# Altium schematic sheet DomOctopus.SchDoc
size A3
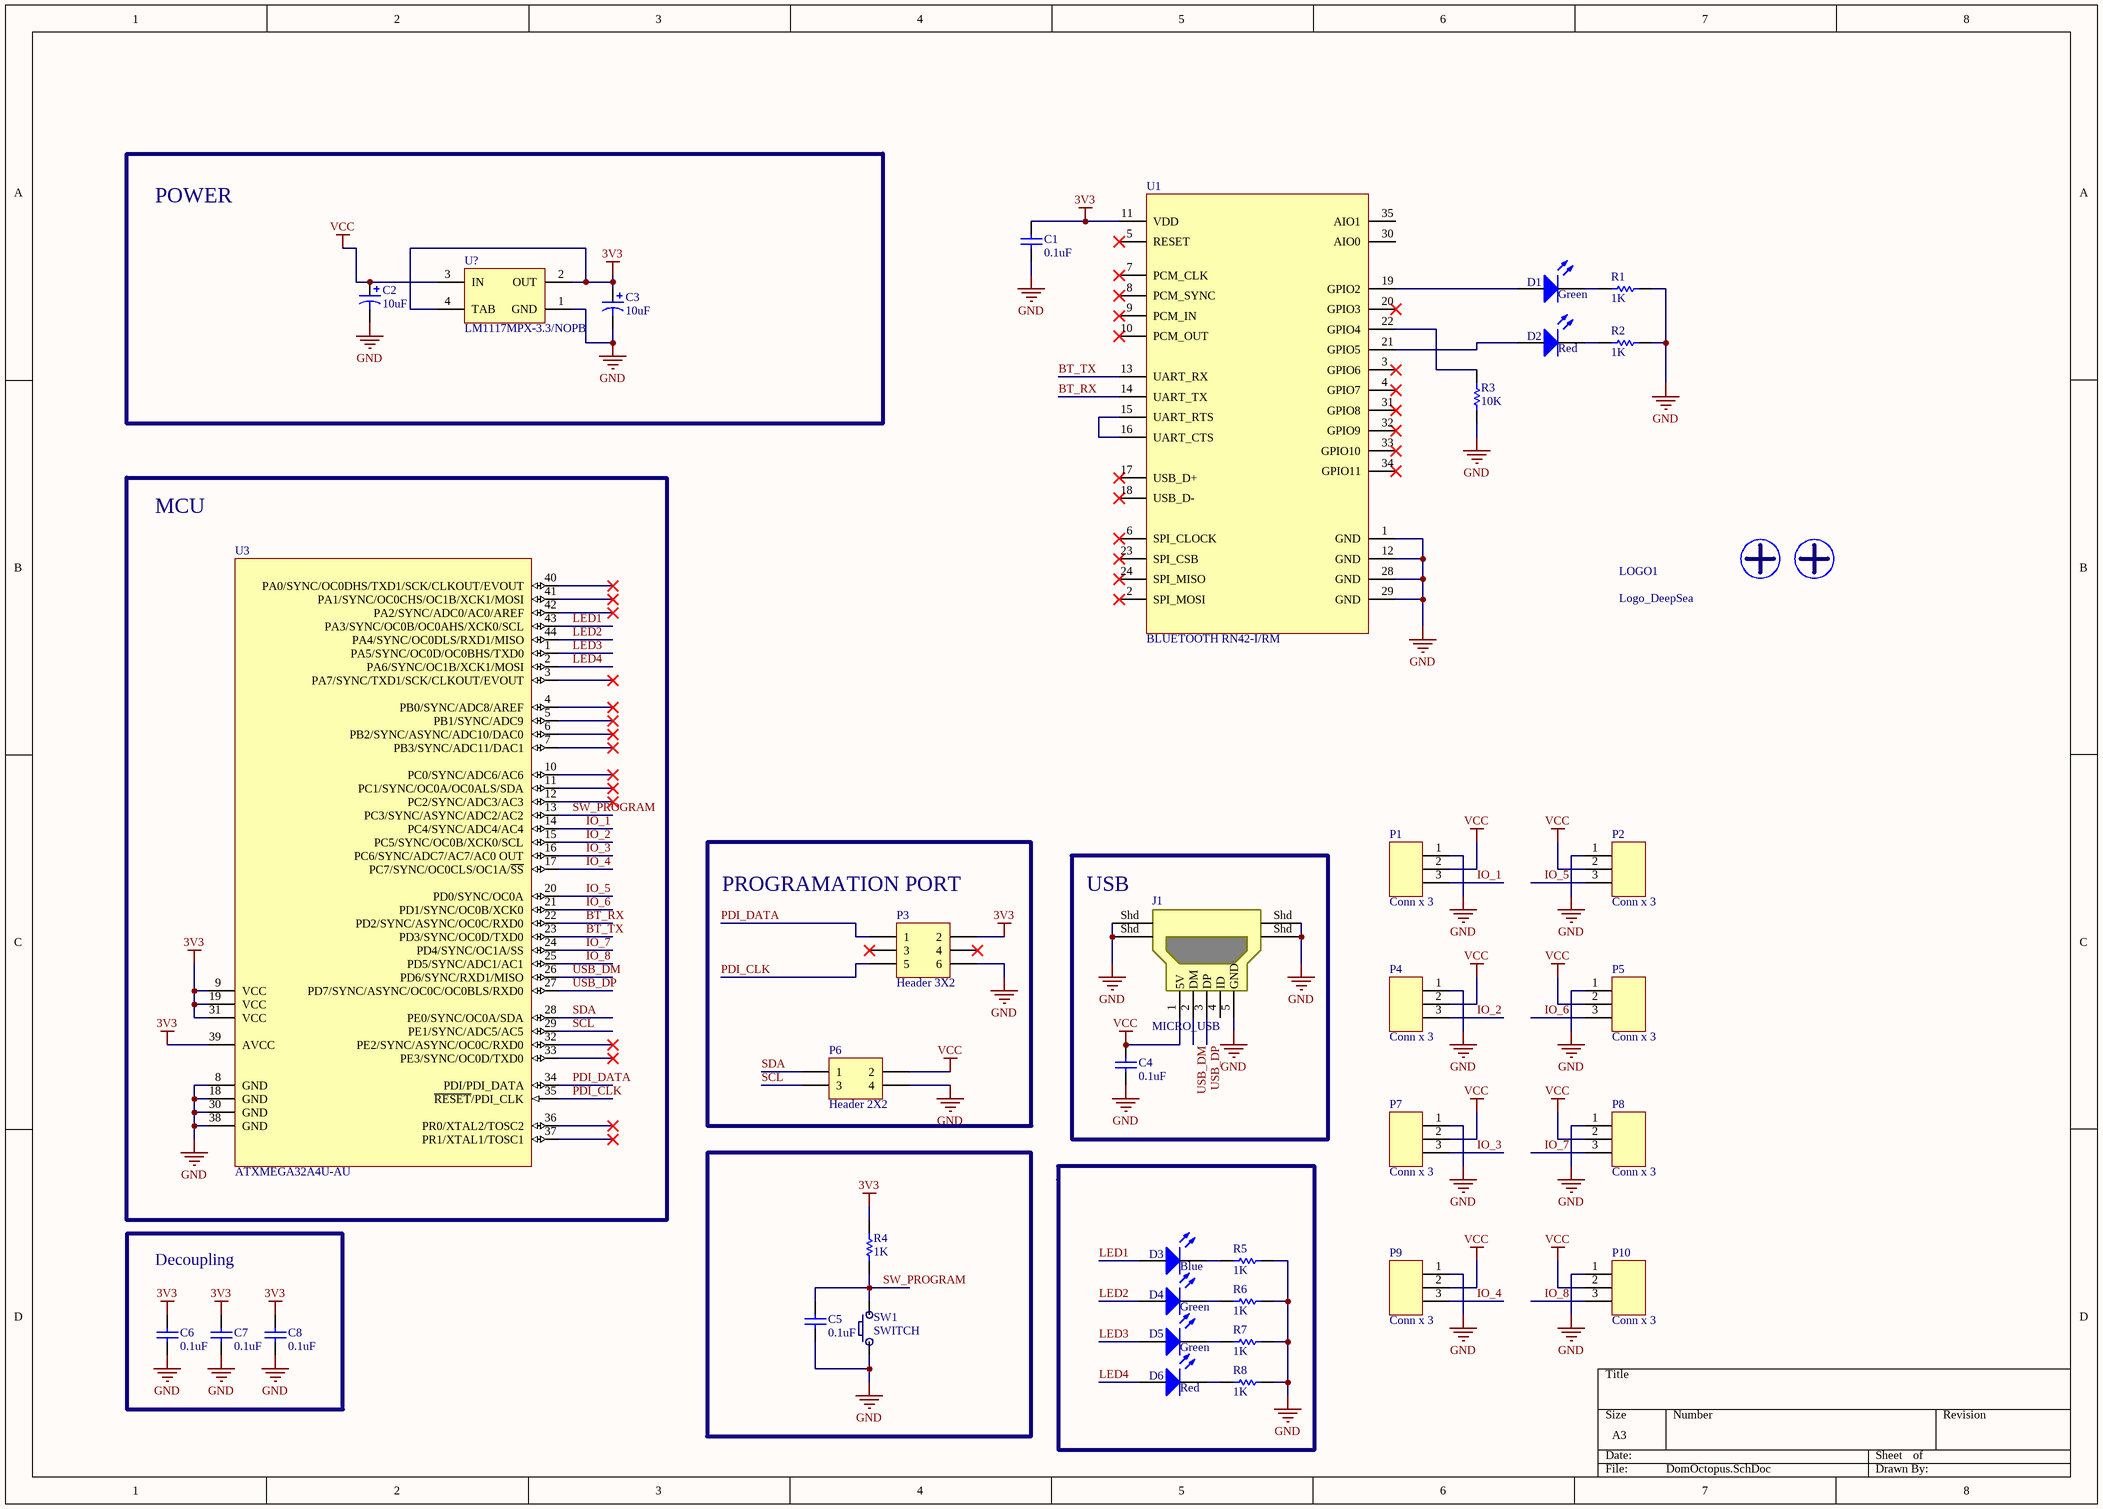
[diagram p0: DomOctopus.SchDoc]

## Parts
C1  0.1uF  [C0603_N]
C2  10uF  [C_TANT_A_3216_N]
C3  10uF  [C_TANT_A_3216_N]
C4  0.1uF  [C0603_N]
C5  0.1uF  [C0603_N]
C6  0.1uF  [C0603_N]
C7  0.1uF  [C0603_N]
C8  0.1uF  [C0603_N]
D1  Green  [R0603_N]
D2  Red  [R0603_N]
D3  Blue  [R0603_N]
D4  Green  [R0603_N]
D5  Green  [R0603_N]
D6  Red  [R0603_N]
J1  MICRO_USB  [USB_MICRO_SMD]
LOGO1  Logo_DeepSea  [DeepSea_logo1]
M1  MountingHole-1/8in  [MoutingHole-1/8in]  (value not drawn)
M2  MountingHole-1/8in  [MoutingHole-1/8in]  (value not drawn)
P1  Conn x 3  [conn x 3]
P2  Conn x 3  [conn x 3]
P3  Header 3X2  [HDR2X3]
P4  Conn x 3  [conn x 3]
P5  Conn x 3  [conn x 3]
P6  Header 2X2  [HDR2X2]
P7  Conn x 3  [conn x 3]
P8  Conn x 3  [conn x 3]
P9  Conn x 3  [conn x 3]
P10  Conn x 3  [conn x 3]
R1  1K  [R0603_N]
R2  1K  [R0603_N]
R3  10K  [R0603_N]
R4  1K  [R0603_N]
R5  1K  [R0603_N]
R6  1K  [R0603_N]
R7  1K  [R0603_N]
R8  1K  [R0603_N]
SW1  SWITCH  [swich_foot]
U1  BLUETOOTH RN42-I/RM  [RN42]
U3  ATXMEGA32A4U-AU  [44A_M]
U?  LM1117MPX-3.3/NOPB  [MP04A_N]

## Nets
3V3: C1.2 C3.1 C6.2 C7.2 C8.2 P3.2 R4.2 U1.11(VDD) U3.9(VCC) U3.19(VCC) U3.31(VCC) U3.39(AVCC) U?.2(OUT) U?.4(TAB)
GND: C1.1 C2.2 C3.2 C4.1 C5.2 C6.1 C7.1 C8.1 J1.5(GND) J1.Shd P1.1 P2.1 P3.6 P4.1 P5.1 P6.4 P7.1 P8.1 P9.1 P10.1 R1.1 R2.1 R3.2 R5.1 R6.1 R7.1 R8.1 SW1.1 U1.1(GND) U1.12(GND) U1.28(GND) U1.29(GND) U3.8(GND) U3.18(GND) U3.30(GND) U3.38(GND) U?.1(GND)
VCC: C2.1 C4.2 J1.1(5V) P1.2 P2.2 P4.2 P5.2 P6.2 P7.2 P8.2 P9.2 P10.2 U?.3(IN)
BT_RX: U1.14(UART_TX) U3.22(PD2/SYNC/ASYNC/OC0C/RXD0)
BT_TX: U1.13(UART_RX) U3.23(PD3/SYNC/OC0D/TXD0)
IO_1: P1.3 U3.14(PC4/SYNC/ADC4/AC4)
IO_2: P4.3 U3.15(PC5/SYNC/OC0B/XCK0/SCL)
IO_3: P7.3 U3.16(PC6/SYNC/ADC7/AC7/AC0_OUT)
IO_4: P9.3 U3.17(PC7/SYNC/OC0CLS/OC1A/~{SS})
IO_5: P2.3 U3.20(PD0/SYNC/OC0A)
IO_6: P5.3 U3.21(PD1/SYNC/OC0B/XCK0)
IO_7: P8.3 U3.24(PD4/SYNC/OC1A/SS)
IO_8: P10.3 U3.25(PD5/SYNC/ADC1/AC1)
LED1: D3.1(A) U3.43(PA3/SYNC/OC0B/OC0AHS/XCK0/SCL)
LED2: D4.1(A) U3.44(PA4/SYNC/OC0DLS/RXD1/MISO)
LED3: D5.1(A) U3.1(PA5/SYNC/OC0D/OC0BHS/TXD0)
LED4: D6.1(A) U3.2(PA6/SYNC/OC1B/XCK1/MOSI)
PDI_CLK: P3.5 U3.35(~{RESET}/PDI_CLK)
PDI_DATA: P3.1 U3.34(PDI/PDI_DATA)
SCL: P6.3 U3.29(PE1/SYNC/ADC5/AC5)
SDA: P6.1 U3.28(PE0/SYNC/OC0A/SDA)
SW_PROGRAM: C5.1 R4.1 SW1.2 U3.13(PC3/SYNC/ASYNC/ADC2/AC2)
USB_DM: J1.2(DM) U3.26(PD6/SYNC/RXD1/MISO)
USB_DP: J1.3(DP) U3.27(PD7/SYNC/ASYNC/OC0C/OC0BLS/RXD0)
NetD1_1: D1.1(A) U1.19(GPIO2)
NetD1_2: D1.2(K) R1.2
NetD2_1: D2.1(A) U1.21(GPIO5)
NetD2_2: D2.2(K) R2.2
NetD3_2: D3.2(K) R5.2
NetD4_2: D4.2(K) R6.2
NetD5_2: D5.2(K) R7.2
NetD6_2: D6.2(K) R8.2
NetR3_1: R3.1 U1.22(GPIO4)
NetU1_15: U1.15(UART_RTS) U1.16(UART_CTS)

Not connected (* = marked no-connect by the designer): J1 4(ID); P3 3* 4*; U1 2(SPI_MOSI)* 3(GPIO6)* 4(GPIO7)* 5(RESET)* 6(SPI_CLOCK)* 7(PCM_CLK)* 8(PCM_SYNC)* 9(PCM_IN)* 10(PCM_OUT)* 17(USB_D+)* 18(USB_D-)* 20(GPIO3)* 23(SPI_CSB)* 24(SPI_MISO)* 30(AIO0) 31(GPIO8)* 32(GPIO9)* 33(GPIO10)* 34(GPIO11)* 35(AIO1); U3 3(PA7/SYNC/TXD1/SCK/CLKOUT/EVOUT)* 4(PB0/SYNC/ADC8/AREF)* 5(PB1/SYNC/ADC9)* 6(PB2/SYNC/ASYNC/ADC10/DAC0)* 7(PB3/SYNC/ADC11/DAC1)* 10(PC0/SYNC/ADC6/AC6)* 11(PC1/SYNC/OC0A/OC0ALS/SDA)* 12(PC2/SYNC/ADC3/AC3)* 32(PE2/SYNC/ASYNC/OC0C/RXD0)* 33(PE3/SYNC/OC0D/TXD0)* 36(PR0/XTAL2/TOSC2)* 37(PR1/XTAL1/TOSC1)* 40(PA0/SYNC/OC0DHS/TXD1/SCK/CLKOUT/EVOUT)* 41(PA1/SYNC/OC0CHS/OC1B/XCK1/MOSI)* 42(PA2/SYNC/ADC0/AC0/AREF)*

## Notes on the sheet
- POWER
- MCU
- (near P3) PROGRAMATION PORT
- (near J1) USB
- Decoupling

## Library data of the parts
C1 C4-C8 = C_SMD: Value: 0.1uF
C2 C3 = CP_SMD: Value: 10uF
D1-D6 = LED_SMD
  D1 D4 D5: Color: Green
  D2 D6: Color: Red
  D3: Color: Blue
J1 = MICRO_USB: CONN USB MICRO B RECPT SMT R/A; Manufacturer: FCI; Manufacturer Part Number: 10118194-0001LF; Connector Type: USB - micro B; Number of Contacts: 5; Gender: Receptacle; Specifications: USB 2.0; Supplier 1: Digi-Key; RoHS: RoHS Compliant; Category: Connectors, Interconnects; Stock 1: 9139; Pricing 1: 1=0.46, 10=0.433, 25=0.3712, 50=0.3156, 100=0.3032, 250=0.27224, 500=0.25988 (USD); Packaging: Cut Tape (CT); Mounting Type: Surface Mount, Right Angle, Horizontal; Features: Shielded, Solder Retention; Ingress Protection: -; ComponentLink1URL: http://portal.fciconnect.com/Comergent//fci/drawing/10118194.pdf; ComponentLink1Description: http://portal.fciconnect.com/Comergent//fci/drawing/10118194.pdf; Supplier Part Number 1: 609-4618-1-ND
P1 P2 P4 P5 P7-P10 = Conn x 3: CONN HEADER VERT 3POS .100 TIN; Manufacturer: TE Connectivity; Manufacturer Part Number: 640456-3; Connector Type: Header, Unshrouded; Number of Positions: 3; Number of Positions Loaded: All; Pitch: 0.100" (2.54mm); Supplier 1: Digi-Key; RoHS: RoHS Compliant; Category: Connectors, Interconnects; Stock 1: 62912; Pricing 1: 1=0.2, 10=0.185, 50=0.118, 100=0.1141, 250=0.09832, 500=0.0944, 1000=0.08259, 2500=0.07473, 5000=0.07079 (USD); Packaging: Bulk; Contact Type: Male Pin; Number of Rows: 1; Row Spacing: -; Contact Mating Length: 0.295" (7.49mm); Mounting Type: Through Hole; Termination: Solder; Fastening Type: Friction Lock; Features: -; Contact Finish: Tin; Contact Finish Thickness: -; Color: Natural; ComponentLink1URL: http://www.te.com/commerce/DocumentDelivery/DDEController?Action=srchrtrv&DocNm=640456&DocType=Customer+Drawing&DocLang=English; ComponentLink1Description: http://www.te.com/commerce/DocumentDelivery/DDEController?Action=srchrtrv&DocNm=640456&DocType=Customer+Drawing&DocLang=English; Supplier Part Number 1: A19470-ND
P3 = Header 3X2: Header, 3-Pin, Dual row; LatestRevisionDate: 17-Jul-2002; LatestRevisionNote: Re-released for DXP Platform.; Publisher: Altium Limited
P6 = Header 2X2: Header, 2-Pin, Dual row; LatestRevisionDate: 17-Jul-2002; LatestRevisionNote: Re-released for DXP Platform.; Publisher: Altium Limited
R1-R8 = R_SMD
  R1 R2 R4-R8: Value: 1K
  R3: Value: 10K
SW1 = SWITCH: SWITCH TACTILE SPST-NO 0.05A 12V; Manufacturer: TE Connectivity; Manufacturer Part Number: FSM4JSMATR; Switch Function: Off-Mom; Contact Rating @ Voltage: 0.05A @ 12VDC; Actuator Type: Standard; Actuator Height off PCB, from Pins: 5.00mm; Actuator Orientation: Top Actuated; Outline: 6.00mm x 6.00mm; Illumination: Non-Illuminated; Operating Force: 160gf; Actuator Material: Polyphenylene Sulfide (PPS); Switch Travel: 0.25mm; Mechanical Life: 100,000 Cycles; Supplier 1: Digi-Key; RoHS: RoHS Compliant; Category: Switches; Stock 1: 33712; Pricing 1: 1=0.23, 10=0.223, 25=0.2136, 50=0.2038, 100=0.1843, 250=0.1698, 500=0.15524 (USD); Packaging: Cut Tape (CT); Circuit: SPST-NO; Mounting Type: Surface Mount; Termination Style: Gull Wing; Illumination Voltage (Nominal): -; Illumination Type, Color: -; Ingress Protection: -; Features: -; Operating Temperature: -35°C ~ 85°C; ComponentLink1URL: http://www.te.com/commerce/DocumentDelivery/DDEController?Action=srchrtrv&DocNm=2-1437565-7&DocType=Customer+Drawing&DocLang=English; ComponentLink1Description: http://www.te.com/commerce/DocumentDelivery/DDEController?Action=srchrtrv&DocNm=2-1437565-7&DocType=Customer+Drawing&DocLang=English; Supplier Part Number 1: 450-1759-1-ND
U1 = BLUETOOTH RN42-I/RM: MODULE BLUETOOTH V2.1+EDR; Manufacturer: Microchip Technology; Frequency: 2.4GHz; Data Rate (Max): 3Mbps; Modulation or Protocol: Bluetooth v2.1+EDR, Class 2; Power - Output: 4dBm; Sensitivity: -80dBm; Voltage - Supply: 3 V ~ 3.6 V; Current - Receiving: 25mA; Data Interface: Pads for Pins; Antenna Connector: On-Board, Trace; Supplier 1: Digi-Key; Manufacturer Part Number: RN42-I/RM; RoHS: RoHS Compliant; Category: RF/IF and RFID; Stock 1: 1863; Pricing 1: 1=18.32, 10=15.27, 25=13.9624 (USD); Packaging: Tray; Applications: General Purpose; Current - Transmitting: 25mA; Memory Size: -; Operating Temperature: -40°C ~ 85°C; Package / Case: 35-SMD Module; ComponentLink1URL: http://www.microchip.com/mymicrochip/filehandler.aspx?ddocname=en558090; ComponentLink1Description: http://www.microchip.com/mymicrochip/filehandler.aspx?ddocname=en558090; Supplier Part Number 1: 740-1038-ND
U3 = ATXMEGA32A4U-AU: IC MCU 8BIT 32KB FLASH 44TQFP; Manufacturer: Atmel; Core Processor: AVR; Core Size: 8/16-Bit; Speed: 32MHz; Connectivity: I²C, IrDA, SPI, UART/USART, USB; Peripherals: Brown-out Detect/Reset, DMA, POR, PWM, WDT; Number of I /O: 34; Program Memory Size: 32KB (16K x 16); EEPROM Size: 2K x 8; RAM Size: 4K x 8; Voltage - Supply (Vcc/Vdd): 1.6 V ~ 3.6 V; Data Converters: A/D 12x12b, D/A 2x12b; Oscillator Type: Internal; Supplier 1: Digi-Key; RoHS: RoHS Compliant; Category: Integrated Circuits (ICs); Stock 1: 2077; Pricing 1: 1=3.43, 25=2.1548, 100=1.9152 (USD); Packaging: Tray; Program Memory Type: FLASH; Operating Temperature: -40°C ~ 85°C; Package / Case: 44-TQFP; ComponentLink1URL: http://www.atmel.com/Images/Atmel-8387-8-and16-bit-AVR-Microcontroller-XMEGA-A4U_Datasheet.pdf; ComponentLink1Description: http://www.atmel.com/Images/Atmel-8387-8-and16-bit-AVR-Microcontroller-XMEGA-A4U_Datasheet.pdf; Supplier Part Number 1: ATXMEGA32A4U-AU-ND; Manufacturer Part Number: ATXMEGA32A4U-AU
U? = LM1117MPX-3.3/NOPB: 800mA Low-Dropout Linear Regulator, 4-pin SOT-223, Pb-Free; Manufacturer: National Semiconductor; PackageTopMarking: XYTT*N05A; PowerWise: N; CompType: LDO IC; Published: 1-Mar-2010; DatasheetVersion: Apr-2006; PackageVersion: revB, Apr-2003; PackageReference: MP04A; Publisher: Altium Limited; PackageDescription: Molded SOT-223, 6.50 x 3.56 x 1.6mm Body, 4 Lead, 2.3mm Pitch; Supplier 1: Digi-Key; Supplier Part Number 1: LM1117MPX-3.3TR-ND; Supplier 2: Digi-Key; Supplier Part Number 2: LM1117MPX-3.3CT-ND; Supplier 3: Digi-Key; Supplier Part Number 3: LM1117MPX-3.3DKR-ND; PartNumber: LM1117MPX-3.3/NOPB; RoHS: Y; PinCount: 4; Code_JEDEC: TO-261-AA; Code_IPC: SOT223-4; ComponentLink1Description: LM1117 Datasheet; ComponentLink1URL: http://www.national.com/ds/LM/LM1117.pdf; ComponentLink2Description: LM1117 Web Page; ComponentLink2URL: http://www.national.com/pf/LM/LM1117.html; ComponentLink3Description: MP04A Package Page; ComponentLink3URL: http://www.national.com/packaging/folders/mp04a.html